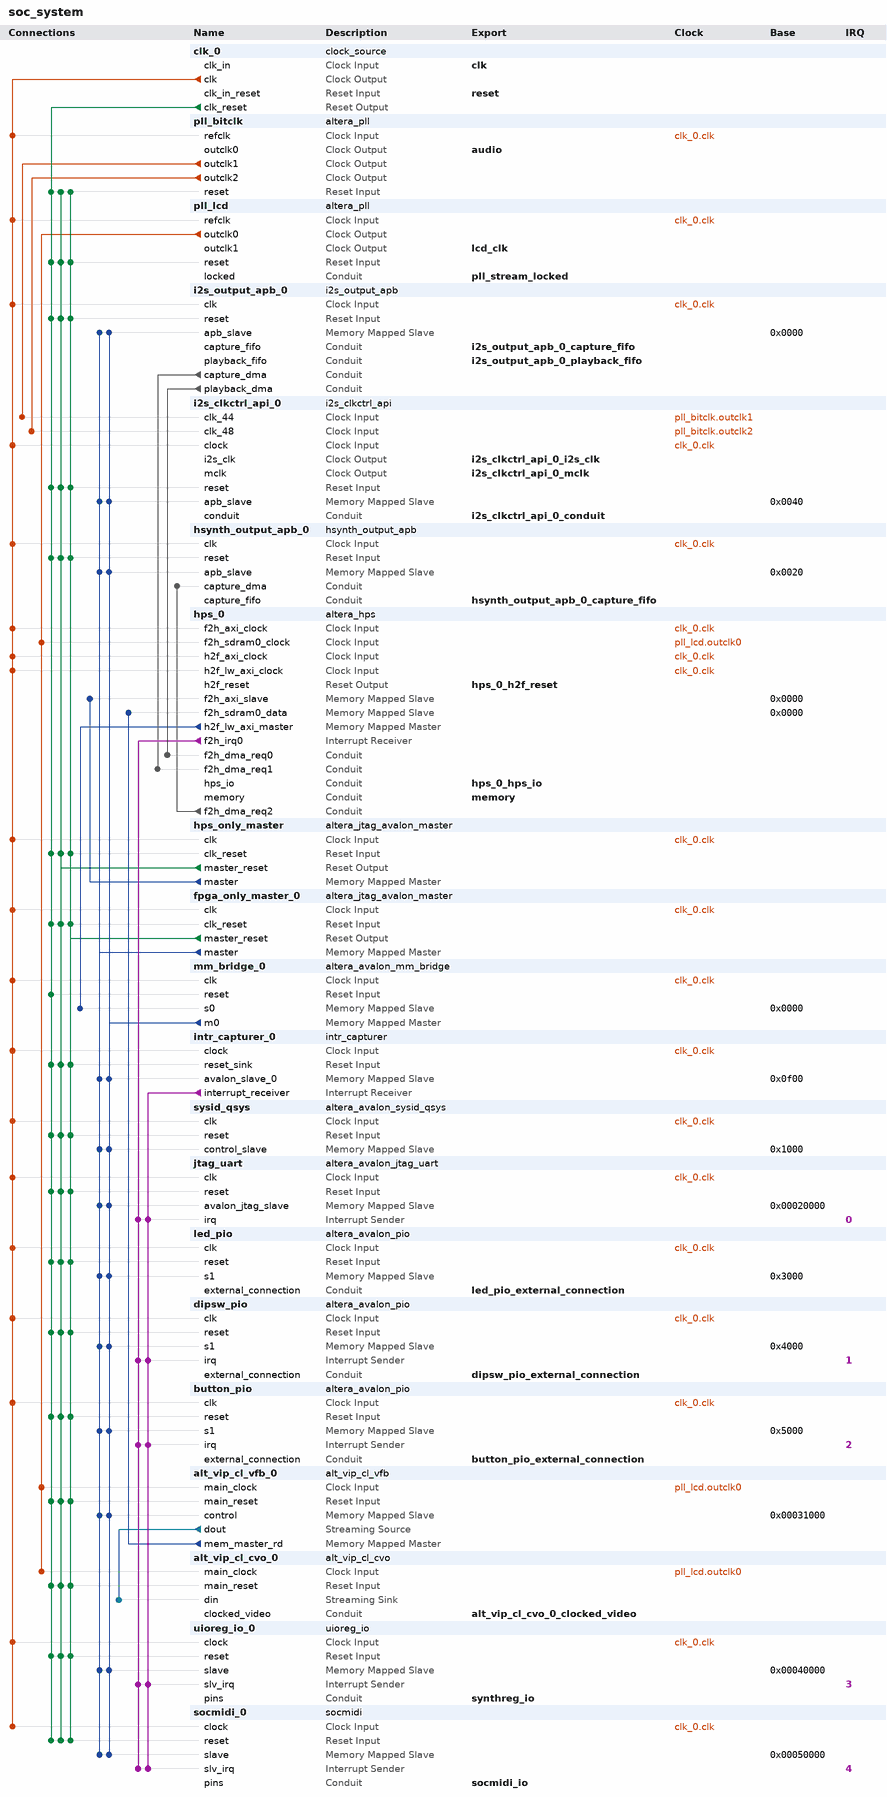
[diagram p0: system contents]
# Platform Designer (Qsys) system soc_system, Cyclone V 5CSEMA5F31C6
# Parameters at their usual value, and those the tool derives, are not listed.
package require -exact qsys 17.1
create_system soc_system
set_project_property DEVICE_FAMILY {Cyclone V}
set_project_property DEVICE 5CSEMA5F31C6

add_instance clk_0 clock_source 17.1
set_instance_parameter_value clk_0 clockFrequency 50000000

add_instance pll_bitclk altera_pll 17.1
set_instance_parameter_value pll_bitclk gui_actual_output_clock_frequency0 {98.333333 MHz}
set_instance_parameter_value pll_bitclk gui_device_speed_grade 2
set_instance_parameter_value pll_bitclk gui_number_of_clocks 3
set_instance_parameter_value pll_bitclk gui_operation_mode direct
set_instance_parameter_value pll_bitclk gui_output_clock_frequency0 90.416666
set_instance_parameter_value pll_bitclk gui_output_clock_frequency1 33.90625
set_instance_parameter_value pll_bitclk gui_output_clock_frequency2 24.675
set_instance_parameter_value pll_bitclk gui_pll_mode {Integer-N PLL}
set_instance_parameter_value pll_bitclk gui_reference_clock_frequency 50.0
set_instance_parameter_value pll_bitclk gui_use_locked false

add_instance pll_lcd altera_pll 17.1
set_instance_parameter_value pll_lcd gui_device_speed_grade 2
set_instance_parameter_value pll_lcd gui_number_of_clocks 2
set_instance_parameter_value pll_lcd gui_operation_mode normal
set_instance_parameter_value pll_lcd gui_output_clock_frequency0 150.0
set_instance_parameter_value pll_lcd gui_output_clock_frequency1 75.0
set_instance_parameter_value pll_lcd gui_pll_mode {Integer-N PLL}
set_instance_parameter_value pll_lcd gui_reference_clock_frequency 50.0
set_instance_parameter_value pll_lcd gui_use_locked true

add_instance i2s_output_apb_0 i2s_output_apb 1.4

add_instance i2s_clkctrl_api_0 i2s_clkctrl_api 1.7

add_instance hsynth_output_apb_0 hsynth_output_apb 1.4

add_instance hps_0 altera_hps 17.1
set_instance_parameter_value hps_0 DMA_Enable Yes,Yes,Yes,No,No,No,No,No
set_instance_parameter_value hps_0 EMAC1_Mode RGMII
set_instance_parameter_value hps_0 EMAC1_PinMuxing {HPS I/O Set 0}
set_instance_parameter_value hps_0 F2SCLK_COLDRST_Enable false
set_instance_parameter_value hps_0 F2SCLK_DBGRST_Enable false
set_instance_parameter_value hps_0 F2SCLK_WARMRST_Enable false
set_instance_parameter_value hps_0 F2SDRAM_Type AXI-3
set_instance_parameter_value hps_0 F2SDRAM_Width 128
set_instance_parameter_value hps_0 F2SINTERRUPT_Enable true
set_instance_parameter_value hps_0 F2S_Width 3
set_instance_parameter_value hps_0 FPGA_PERIPHERAL_OUTPUT_CLOCK_FREQ_EMAC0_GTX_CLK 100
set_instance_parameter_value hps_0 FPGA_PERIPHERAL_OUTPUT_CLOCK_FREQ_EMAC0_MD_CLK 100.0
set_instance_parameter_value hps_0 FPGA_PERIPHERAL_OUTPUT_CLOCK_FREQ_EMAC1_GTX_CLK 100
set_instance_parameter_value hps_0 FPGA_PERIPHERAL_OUTPUT_CLOCK_FREQ_EMAC1_MD_CLK 100.0
set_instance_parameter_value hps_0 HPS_PROTOCOL DDR3
set_instance_parameter_value hps_0 I2C0_Mode I2C
set_instance_parameter_value hps_0 I2C0_PinMuxing {HPS I/O Set 0}
set_instance_parameter_value hps_0 I2C1_Mode I2C
set_instance_parameter_value hps_0 I2C1_PinMuxing {HPS I/O Set 0}
set_instance_parameter_value hps_0 LWH2F_Enable true
set_instance_parameter_value hps_0 MEM_BANKADDR_WIDTH 3
set_instance_parameter_value hps_0 MEM_CLK_FREQ 400.0
set_instance_parameter_value hps_0 MEM_COL_ADDR_WIDTH 10
set_instance_parameter_value hps_0 MEM_DQ_WIDTH 32
set_instance_parameter_value hps_0 MEM_DRV_STR RZQ/7
set_instance_parameter_value hps_0 MEM_ROW_ADDR_WIDTH 15
set_instance_parameter_value hps_0 MEM_RTT_NOM RZQ/4
set_instance_parameter_value hps_0 MEM_RTT_WR RZQ/4
set_instance_parameter_value hps_0 MEM_TCL 11
set_instance_parameter_value hps_0 MEM_TFAW_NS 30.0
set_instance_parameter_value hps_0 MEM_TRAS_NS 35.0
set_instance_parameter_value hps_0 MEM_TRCD_NS 13.75
set_instance_parameter_value hps_0 MEM_TRFC_NS 260.0
set_instance_parameter_value hps_0 MEM_TRP_NS 13.75
set_instance_parameter_value hps_0 MEM_VENDOR JEDEC
set_instance_parameter_value hps_0 MEM_WTCL 8
set_instance_parameter_value hps_0 QSPI_Mode {1 SS}
set_instance_parameter_value hps_0 QSPI_PinMuxing {HPS I/O Set 0}
set_instance_parameter_value hps_0 REF_CLK_FREQ 25.0
set_instance_parameter_value hps_0 S2FCLK_USER2CLK 5
set_instance_parameter_value hps_0 S2F_Width 2
set_instance_parameter_value hps_0 SDIO_Mode {4-bit Data}
set_instance_parameter_value hps_0 SDIO_PinMuxing {HPS I/O Set 0}
set_instance_parameter_value hps_0 SPIM1_Mode {Single Slave Select}
set_instance_parameter_value hps_0 SPIM1_PinMuxing {HPS I/O Set 0}
set_instance_parameter_value hps_0 STM_Enable false
set_instance_parameter_value hps_0 TIMING_BOARD_AC_SKEW 0.03
set_instance_parameter_value hps_0 TIMING_BOARD_AC_TO_CK_SKEW 0.0
set_instance_parameter_value hps_0 TIMING_BOARD_DQ_TO_DQS_SKEW 0.0
set_instance_parameter_value hps_0 TIMING_BOARD_MAX_CK_DELAY 0.03
set_instance_parameter_value hps_0 TIMING_BOARD_MAX_DQS_DELAY 0.02
set_instance_parameter_value hps_0 TIMING_BOARD_SKEW_BETWEEN_DQS 0.08
set_instance_parameter_value hps_0 TIMING_BOARD_SKEW_CKDQS_DIMM_MAX 0.16
set_instance_parameter_value hps_0 TIMING_BOARD_SKEW_CKDQS_DIMM_MIN 0.09
set_instance_parameter_value hps_0 TIMING_BOARD_SKEW_WITHIN_DQS 0.01
set_instance_parameter_value hps_0 TIMING_TDH 65
set_instance_parameter_value hps_0 TIMING_TDQSCK 255
set_instance_parameter_value hps_0 TIMING_TDQSQ 125
set_instance_parameter_value hps_0 TIMING_TDS 30
set_instance_parameter_value hps_0 TIMING_TIH 140
set_instance_parameter_value hps_0 TIMING_TIS 180
set_instance_parameter_value hps_0 TIMING_TQSH 0.4
set_instance_parameter_value hps_0 UART0_Mode {No Flow Control}
set_instance_parameter_value hps_0 UART0_PinMuxing {HPS I/O Set 0}
set_instance_parameter_value hps_0 USB1_Mode SDR
set_instance_parameter_value hps_0 USB1_PinMuxing {HPS I/O Set 0}
set_instance_parameter_value hps_0 desired_cfg_clk_mhz 100.0
set_instance_parameter_value hps_0 desired_mpu_clk_mhz 920.0
set_instance_parameter_value hps_0 desired_qspi_clk_mhz 370.0

add_instance hps_only_master altera_jtag_avalon_master 17.1

add_instance fpga_only_master_0 altera_jtag_avalon_master 17.1

add_instance mm_bridge_0 altera_avalon_mm_bridge 17.1
set_instance_parameter_value mm_bridge_0 ADDRESS_UNITS SYMBOLS
set_instance_parameter_value mm_bridge_0 ADDRESS_WIDTH 10
set_instance_parameter_value mm_bridge_0 DATA_WIDTH 32
set_instance_parameter_value mm_bridge_0 MAX_PENDING_RESPONSES 4
set_instance_parameter_value mm_bridge_0 USE_AUTO_ADDRESS_WIDTH 1

add_instance intr_capturer_0 intr_capturer 100.99.98.97

add_instance sysid_qsys altera_avalon_sysid_qsys 17.1
set_instance_parameter_value sysid_qsys id -1395322110

add_instance jtag_uart altera_avalon_jtag_uart 17.1
set_instance_parameter_value jtag_uart allowMultipleConnections true
set_instance_parameter_value jtag_uart simInteractiveOptions INTERACTIVE_ASCII_OUTPUT

add_instance led_pio altera_avalon_pio 17.1
set_instance_parameter_value led_pio direction Output
set_instance_parameter_value led_pio width 10

add_instance dipsw_pio altera_avalon_pio 17.1
set_instance_parameter_value dipsw_pio bitClearingEdgeCapReg true
set_instance_parameter_value dipsw_pio captureEdge true
set_instance_parameter_value dipsw_pio direction Input
set_instance_parameter_value dipsw_pio edgeType ANY
set_instance_parameter_value dipsw_pio generateIRQ true
set_instance_parameter_value dipsw_pio irqType EDGE
set_instance_parameter_value dipsw_pio width 10

add_instance button_pio altera_avalon_pio 17.1
set_instance_parameter_value button_pio bitClearingEdgeCapReg true
set_instance_parameter_value button_pio captureEdge true
set_instance_parameter_value button_pio direction Input
set_instance_parameter_value button_pio edgeType FALLING
set_instance_parameter_value button_pio generateIRQ true
set_instance_parameter_value button_pio irqType EDGE
set_instance_parameter_value button_pio width 2

add_instance alt_vip_cl_vfb_0 alt_vip_cl_vfb 17.1
set_instance_parameter_value alt_vip_cl_vfb_0 CLOCKS_ARE_SEPARATE 0
set_instance_parameter_value alt_vip_cl_vfb_0 DROP_FRAMES 1
set_instance_parameter_value alt_vip_cl_vfb_0 DROP_INVALID_FIELDS 1
set_instance_parameter_value alt_vip_cl_vfb_0 DROP_REPEAT_USER 0
set_instance_parameter_value alt_vip_cl_vfb_0 IS_FRAME_READER 1
set_instance_parameter_value alt_vip_cl_vfb_0 LINE_BASED_BUFFERING 0
set_instance_parameter_value alt_vip_cl_vfb_0 MAX_HEIGHT 768
set_instance_parameter_value alt_vip_cl_vfb_0 MAX_WIDTH 1366
set_instance_parameter_value alt_vip_cl_vfb_0 MEM_BASE_ADDR 536870912
set_instance_parameter_value alt_vip_cl_vfb_0 MEM_BUFFER_OFFSET 16777216
set_instance_parameter_value alt_vip_cl_vfb_0 MEM_PORT_WIDTH 512
set_instance_parameter_value alt_vip_cl_vfb_0 NUMBER_OF_COLOR_PLANES 4
set_instance_parameter_value alt_vip_cl_vfb_0 READER_RUNTIME_CONTROL 1
set_instance_parameter_value alt_vip_cl_vfb_0 READ_BURST_TARGET 64
set_instance_parameter_value alt_vip_cl_vfb_0 READ_FIFO_DEPTH 512
set_instance_parameter_value alt_vip_cl_vfb_0 USER_PACKETS_MAX_STORAGE 0
set_instance_parameter_value alt_vip_cl_vfb_0 USE_BUFFER_OFFSET 0
set_instance_parameter_value alt_vip_cl_vfb_0 WRITE_BURST_TARGET 64
set_instance_parameter_value alt_vip_cl_vfb_0 WRITE_FIFO_DEPTH 512

add_instance alt_vip_cl_cvo_0 alt_vip_cl_cvo 17.1
set_instance_parameter_value alt_vip_cl_cvo_0 ACCEPT_COLOURS_IN_SEQ 0
set_instance_parameter_value alt_vip_cl_cvo_0 ACCEPT_SYNC 0
set_instance_parameter_value alt_vip_cl_cvo_0 ANC_LINE 0
set_instance_parameter_value alt_vip_cl_cvo_0 AP_LINE 0
set_instance_parameter_value alt_vip_cl_cvo_0 BPS 8
set_instance_parameter_value alt_vip_cl_cvo_0 CLOCKS_ARE_SAME 0
set_instance_parameter_value alt_vip_cl_cvo_0 COLOUR_PLANES_ARE_IN_PARALLEL 1
set_instance_parameter_value alt_vip_cl_cvo_0 CONTEXT_WIDTH 8
set_instance_parameter_value alt_vip_cl_cvo_0 COUNT_STEP_IS_PIP_VALUE 0
set_instance_parameter_value alt_vip_cl_cvo_0 DST_WIDTH 8
set_instance_parameter_value alt_vip_cl_cvo_0 FIELD0_ANC_LINE 0
set_instance_parameter_value alt_vip_cl_cvo_0 FIELD0_V_BACK_PORCH 0
set_instance_parameter_value alt_vip_cl_cvo_0 FIELD0_V_BLANK 0
set_instance_parameter_value alt_vip_cl_cvo_0 FIELD0_V_FRONT_PORCH 0
set_instance_parameter_value alt_vip_cl_cvo_0 FIELD0_V_RISING_EDGE 0
set_instance_parameter_value alt_vip_cl_cvo_0 FIELD0_V_SYNC_LENGTH 0
set_instance_parameter_value alt_vip_cl_cvo_0 FIFO_DEPTH 1366
set_instance_parameter_value alt_vip_cl_cvo_0 F_FALLING_EDGE 0
set_instance_parameter_value alt_vip_cl_cvo_0 F_RISING_EDGE 0
set_instance_parameter_value alt_vip_cl_cvo_0 GENERATE_SYNC 0
set_instance_parameter_value alt_vip_cl_cvo_0 H_ACTIVE_PIXELS 1366
set_instance_parameter_value alt_vip_cl_cvo_0 H_BACK_PORCH 16
set_instance_parameter_value alt_vip_cl_cvo_0 H_BLANK 0
set_instance_parameter_value alt_vip_cl_cvo_0 H_FRONT_PORCH 40
set_instance_parameter_value alt_vip_cl_cvo_0 H_SYNC_LENGTH 32
set_instance_parameter_value alt_vip_cl_cvo_0 INTERLACED 0
set_instance_parameter_value alt_vip_cl_cvo_0 LOW_LATENCY 0
set_instance_parameter_value alt_vip_cl_cvo_0 NO_OF_CHANNELS 1
set_instance_parameter_value alt_vip_cl_cvo_0 NO_OF_MODES 1
set_instance_parameter_value alt_vip_cl_cvo_0 NUMBER_OF_COLOUR_PLANES 4
set_instance_parameter_value alt_vip_cl_cvo_0 PIXELS_IN_PARALLEL 1
set_instance_parameter_value alt_vip_cl_cvo_0 SRC_WIDTH 8
set_instance_parameter_value alt_vip_cl_cvo_0 STD_WIDTH 1
set_instance_parameter_value alt_vip_cl_cvo_0 TASK_WIDTH 8
set_instance_parameter_value alt_vip_cl_cvo_0 THRESHOLD 1365
set_instance_parameter_value alt_vip_cl_cvo_0 USE_CONTROL 0
set_instance_parameter_value alt_vip_cl_cvo_0 USE_EMBEDDED_SYNCS 0
set_instance_parameter_value alt_vip_cl_cvo_0 V_ACTIVE_LINES 768
set_instance_parameter_value alt_vip_cl_cvo_0 V_BACK_PORCH 16
set_instance_parameter_value alt_vip_cl_cvo_0 V_BLANK 0
set_instance_parameter_value alt_vip_cl_cvo_0 V_FRONT_PORCH 5
set_instance_parameter_value alt_vip_cl_cvo_0 V_SYNC_LENGTH 4

add_instance uioreg_io_0 uioreg_io 1.1
set_instance_parameter_value uioreg_io_0 ADDRESS_WIDTH 10
set_instance_parameter_value uioreg_io_0 DATA_WIDTH 32
set_instance_parameter_value uioreg_io_0 IRQ_EN 1

add_instance socmidi_0 socmidi 1.0
set_instance_parameter_value socmidi_0 ADDRESS_WIDTH 3
set_instance_parameter_value socmidi_0 DATA_WIDTH 8
set_instance_parameter_value socmidi_0 IRQ_EN 0

# connections
add_connection clk_0.clk button_pio.clk clock
add_connection clk_0.clk dipsw_pio.clk clock
add_connection clk_0.clk fpga_only_master_0.clk clock
add_connection clk_0.clk hps_0.f2h_axi_clock clock
add_connection clk_0.clk hps_0.h2f_axi_clock clock
add_connection clk_0.clk hps_0.h2f_lw_axi_clock clock
add_connection clk_0.clk hps_only_master.clk clock
add_connection clk_0.clk hsynth_output_apb_0.clk clock
add_connection clk_0.clk i2s_clkctrl_api_0.clock clock
add_connection clk_0.clk i2s_output_apb_0.clk clock
add_connection clk_0.clk intr_capturer_0.clock clock
add_connection clk_0.clk jtag_uart.clk clock
add_connection clk_0.clk led_pio.clk clock
add_connection clk_0.clk mm_bridge_0.clk clock
add_connection clk_0.clk pll_bitclk.refclk clock
add_connection clk_0.clk pll_lcd.refclk clock
add_connection clk_0.clk socmidi_0.clock clock
add_connection clk_0.clk sysid_qsys.clk clock
add_connection clk_0.clk uioreg_io_0.clock clock
add_connection pll_bitclk.outclk1 i2s_clkctrl_api_0.clk_44 clock
add_connection pll_bitclk.outclk2 i2s_clkctrl_api_0.clk_48 clock
add_connection pll_lcd.outclk0 alt_vip_cl_cvo_0.main_clock clock
add_connection pll_lcd.outclk0 alt_vip_cl_vfb_0.main_clock clock
add_connection pll_lcd.outclk0 hps_0.f2h_sdram0_clock clock
add_connection clk_0.clk_reset alt_vip_cl_cvo_0.main_reset reset
add_connection clk_0.clk_reset alt_vip_cl_vfb_0.main_reset reset
add_connection clk_0.clk_reset button_pio.reset reset
add_connection clk_0.clk_reset dipsw_pio.reset reset
add_connection clk_0.clk_reset fpga_only_master_0.clk_reset reset
add_connection clk_0.clk_reset hps_only_master.clk_reset reset
add_connection clk_0.clk_reset hsynth_output_apb_0.reset reset
add_connection clk_0.clk_reset i2s_clkctrl_api_0.reset reset
add_connection clk_0.clk_reset i2s_output_apb_0.reset reset
add_connection clk_0.clk_reset intr_capturer_0.reset_sink reset
add_connection clk_0.clk_reset jtag_uart.reset reset
add_connection clk_0.clk_reset led_pio.reset reset
add_connection clk_0.clk_reset mm_bridge_0.reset reset
add_connection clk_0.clk_reset pll_bitclk.reset reset
add_connection clk_0.clk_reset pll_lcd.reset reset
add_connection clk_0.clk_reset socmidi_0.reset reset
add_connection clk_0.clk_reset sysid_qsys.reset reset
add_connection clk_0.clk_reset uioreg_io_0.reset reset
add_connection fpga_only_master_0.master_reset alt_vip_cl_cvo_0.main_reset reset
add_connection fpga_only_master_0.master_reset alt_vip_cl_vfb_0.main_reset reset
add_connection fpga_only_master_0.master_reset button_pio.reset reset
add_connection fpga_only_master_0.master_reset dipsw_pio.reset reset
add_connection fpga_only_master_0.master_reset fpga_only_master_0.clk_reset reset
add_connection fpga_only_master_0.master_reset hps_only_master.clk_reset reset
add_connection fpga_only_master_0.master_reset hsynth_output_apb_0.reset reset
add_connection fpga_only_master_0.master_reset i2s_clkctrl_api_0.reset reset
add_connection fpga_only_master_0.master_reset i2s_output_apb_0.reset reset
add_connection fpga_only_master_0.master_reset intr_capturer_0.reset_sink reset
add_connection fpga_only_master_0.master_reset jtag_uart.reset reset
add_connection fpga_only_master_0.master_reset led_pio.reset reset
add_connection fpga_only_master_0.master_reset pll_bitclk.reset reset
add_connection fpga_only_master_0.master_reset pll_lcd.reset reset
add_connection fpga_only_master_0.master_reset socmidi_0.reset reset
add_connection fpga_only_master_0.master_reset sysid_qsys.reset reset
add_connection fpga_only_master_0.master_reset uioreg_io_0.reset reset
add_connection hps_only_master.master_reset alt_vip_cl_cvo_0.main_reset reset
add_connection hps_only_master.master_reset alt_vip_cl_vfb_0.main_reset reset
add_connection hps_only_master.master_reset button_pio.reset reset
add_connection hps_only_master.master_reset dipsw_pio.reset reset
add_connection hps_only_master.master_reset fpga_only_master_0.clk_reset reset
add_connection hps_only_master.master_reset hps_only_master.clk_reset reset
add_connection hps_only_master.master_reset hsynth_output_apb_0.reset reset
add_connection hps_only_master.master_reset i2s_clkctrl_api_0.reset reset
add_connection hps_only_master.master_reset i2s_output_apb_0.reset reset
add_connection hps_only_master.master_reset intr_capturer_0.reset_sink reset
add_connection hps_only_master.master_reset jtag_uart.reset reset
add_connection hps_only_master.master_reset led_pio.reset reset
add_connection hps_only_master.master_reset pll_bitclk.reset reset
add_connection hps_only_master.master_reset pll_lcd.reset reset
add_connection hps_only_master.master_reset socmidi_0.reset reset
add_connection hps_only_master.master_reset sysid_qsys.reset reset
add_connection hps_only_master.master_reset uioreg_io_0.reset reset
add_connection alt_vip_cl_vfb_0.mem_master_rd hps_0.f2h_sdram0_data avalon
set_connection_parameter_value alt_vip_cl_vfb_0.mem_master_rd/hps_0.f2h_sdram0_data baseAddress 0x0000
add_connection fpga_only_master_0.master alt_vip_cl_vfb_0.control avalon
set_connection_parameter_value fpga_only_master_0.master/alt_vip_cl_vfb_0.control baseAddress 0x00031000
add_connection fpga_only_master_0.master button_pio.s1 avalon
set_connection_parameter_value fpga_only_master_0.master/button_pio.s1 baseAddress 0x5000
add_connection fpga_only_master_0.master dipsw_pio.s1 avalon
set_connection_parameter_value fpga_only_master_0.master/dipsw_pio.s1 baseAddress 0x4000
add_connection fpga_only_master_0.master hsynth_output_apb_0.apb_slave avalon
set_connection_parameter_value fpga_only_master_0.master/hsynth_output_apb_0.apb_slave baseAddress 0x0020
add_connection fpga_only_master_0.master i2s_clkctrl_api_0.apb_slave avalon
set_connection_parameter_value fpga_only_master_0.master/i2s_clkctrl_api_0.apb_slave baseAddress 0x0040
add_connection fpga_only_master_0.master i2s_output_apb_0.apb_slave avalon
set_connection_parameter_value fpga_only_master_0.master/i2s_output_apb_0.apb_slave baseAddress 0x0000
add_connection fpga_only_master_0.master intr_capturer_0.avalon_slave_0 avalon
set_connection_parameter_value fpga_only_master_0.master/intr_capturer_0.avalon_slave_0 baseAddress 0x0f00
add_connection fpga_only_master_0.master jtag_uart.avalon_jtag_slave avalon
set_connection_parameter_value fpga_only_master_0.master/jtag_uart.avalon_jtag_slave baseAddress 0x00020000
add_connection fpga_only_master_0.master led_pio.s1 avalon
set_connection_parameter_value fpga_only_master_0.master/led_pio.s1 baseAddress 0x3000
add_connection fpga_only_master_0.master socmidi_0.slave avalon
set_connection_parameter_value fpga_only_master_0.master/socmidi_0.slave baseAddress 0x00050000
add_connection fpga_only_master_0.master sysid_qsys.control_slave avalon
set_connection_parameter_value fpga_only_master_0.master/sysid_qsys.control_slave baseAddress 0x1000
add_connection fpga_only_master_0.master uioreg_io_0.slave avalon
set_connection_parameter_value fpga_only_master_0.master/uioreg_io_0.slave baseAddress 0x00040000
add_connection hps_0.h2f_lw_axi_master mm_bridge_0.s0 avalon
set_connection_parameter_value hps_0.h2f_lw_axi_master/mm_bridge_0.s0 baseAddress 0x0000
add_connection hps_only_master.master hps_0.f2h_axi_slave avalon
set_connection_parameter_value hps_only_master.master/hps_0.f2h_axi_slave baseAddress 0x0000
add_connection mm_bridge_0.m0 alt_vip_cl_vfb_0.control avalon
set_connection_parameter_value mm_bridge_0.m0/alt_vip_cl_vfb_0.control baseAddress 0x00031000
add_connection mm_bridge_0.m0 button_pio.s1 avalon
set_connection_parameter_value mm_bridge_0.m0/button_pio.s1 baseAddress 0x5000
add_connection mm_bridge_0.m0 dipsw_pio.s1 avalon
set_connection_parameter_value mm_bridge_0.m0/dipsw_pio.s1 baseAddress 0x4000
add_connection mm_bridge_0.m0 hsynth_output_apb_0.apb_slave avalon
set_connection_parameter_value mm_bridge_0.m0/hsynth_output_apb_0.apb_slave baseAddress 0x0020
add_connection mm_bridge_0.m0 i2s_clkctrl_api_0.apb_slave avalon
set_connection_parameter_value mm_bridge_0.m0/i2s_clkctrl_api_0.apb_slave baseAddress 0x0040
add_connection mm_bridge_0.m0 i2s_output_apb_0.apb_slave avalon
set_connection_parameter_value mm_bridge_0.m0/i2s_output_apb_0.apb_slave baseAddress 0x0000
add_connection mm_bridge_0.m0 intr_capturer_0.avalon_slave_0 avalon
set_connection_parameter_value mm_bridge_0.m0/intr_capturer_0.avalon_slave_0 baseAddress 0x0f00
add_connection mm_bridge_0.m0 jtag_uart.avalon_jtag_slave avalon
set_connection_parameter_value mm_bridge_0.m0/jtag_uart.avalon_jtag_slave baseAddress 0x00020000
add_connection mm_bridge_0.m0 led_pio.s1 avalon
set_connection_parameter_value mm_bridge_0.m0/led_pio.s1 baseAddress 0x3000
add_connection mm_bridge_0.m0 socmidi_0.slave avalon
set_connection_parameter_value mm_bridge_0.m0/socmidi_0.slave baseAddress 0x00050000
add_connection mm_bridge_0.m0 sysid_qsys.control_slave avalon
set_connection_parameter_value mm_bridge_0.m0/sysid_qsys.control_slave baseAddress 0x1000
add_connection mm_bridge_0.m0 uioreg_io_0.slave avalon
set_connection_parameter_value mm_bridge_0.m0/uioreg_io_0.slave baseAddress 0x00040000
add_connection alt_vip_cl_vfb_0.dout alt_vip_cl_cvo_0.din avalon_streaming
add_connection hps_0.f2h_dma_req2 hsynth_output_apb_0.capture_dma conduit
add_connection i2s_output_apb_0.capture_dma hps_0.f2h_dma_req1 conduit
add_connection i2s_output_apb_0.playback_dma hps_0.f2h_dma_req0 conduit
add_connection hps_0.f2h_irq0 button_pio.irq interrupt
set_connection_parameter_value hps_0.f2h_irq0/button_pio.irq irqNumber 2
add_connection hps_0.f2h_irq0 dipsw_pio.irq interrupt
set_connection_parameter_value hps_0.f2h_irq0/dipsw_pio.irq irqNumber 1
add_connection hps_0.f2h_irq0 jtag_uart.irq interrupt
set_connection_parameter_value hps_0.f2h_irq0/jtag_uart.irq irqNumber 0
add_connection hps_0.f2h_irq0 socmidi_0.slv_irq interrupt
set_connection_parameter_value hps_0.f2h_irq0/socmidi_0.slv_irq irqNumber 4
add_connection hps_0.f2h_irq0 uioreg_io_0.slv_irq interrupt
set_connection_parameter_value hps_0.f2h_irq0/uioreg_io_0.slv_irq irqNumber 3
add_connection intr_capturer_0.interrupt_receiver button_pio.irq interrupt
set_connection_parameter_value intr_capturer_0.interrupt_receiver/button_pio.irq irqNumber 2
add_connection intr_capturer_0.interrupt_receiver dipsw_pio.irq interrupt
set_connection_parameter_value intr_capturer_0.interrupt_receiver/dipsw_pio.irq irqNumber 1
add_connection intr_capturer_0.interrupt_receiver jtag_uart.irq interrupt
set_connection_parameter_value intr_capturer_0.interrupt_receiver/jtag_uart.irq irqNumber 0
add_connection intr_capturer_0.interrupt_receiver socmidi_0.slv_irq interrupt
set_connection_parameter_value intr_capturer_0.interrupt_receiver/socmidi_0.slv_irq irqNumber 4
add_connection intr_capturer_0.interrupt_receiver uioreg_io_0.slv_irq interrupt
set_connection_parameter_value intr_capturer_0.interrupt_receiver/uioreg_io_0.slv_irq irqNumber 3

# exported interfaces
add_interface alt_vip_cl_cvo_0_clocked_video conduit end
set_interface_property alt_vip_cl_cvo_0_clocked_video EXPORT_OF alt_vip_cl_cvo_0.clocked_video
add_interface audio clock source
set_interface_property audio EXPORT_OF pll_bitclk.outclk0
add_interface button_pio_external_connection conduit end
set_interface_property button_pio_external_connection EXPORT_OF button_pio.external_connection
add_interface clk clock sink
set_interface_property clk EXPORT_OF clk_0.clk_in
add_interface dipsw_pio_external_connection conduit end
set_interface_property dipsw_pio_external_connection EXPORT_OF dipsw_pio.external_connection
add_interface hps_0_h2f_reset reset source
set_interface_property hps_0_h2f_reset EXPORT_OF hps_0.h2f_reset
add_interface hps_0_hps_io conduit end
set_interface_property hps_0_hps_io EXPORT_OF hps_0.hps_io
add_interface hsynth_output_apb_0_capture_fifo conduit end
set_interface_property hsynth_output_apb_0_capture_fifo EXPORT_OF hsynth_output_apb_0.capture_fifo
add_interface i2s_clkctrl_api_0_conduit conduit end
set_interface_property i2s_clkctrl_api_0_conduit EXPORT_OF i2s_clkctrl_api_0.conduit
add_interface i2s_clkctrl_api_0_i2s_clk clock source
set_interface_property i2s_clkctrl_api_0_i2s_clk EXPORT_OF i2s_clkctrl_api_0.i2s_clk
add_interface i2s_clkctrl_api_0_mclk clock source
set_interface_property i2s_clkctrl_api_0_mclk EXPORT_OF i2s_clkctrl_api_0.mclk
add_interface i2s_output_apb_0_capture_fifo conduit end
set_interface_property i2s_output_apb_0_capture_fifo EXPORT_OF i2s_output_apb_0.capture_fifo
add_interface i2s_output_apb_0_playback_fifo conduit end
set_interface_property i2s_output_apb_0_playback_fifo EXPORT_OF i2s_output_apb_0.playback_fifo
add_interface lcd_clk clock source
set_interface_property lcd_clk EXPORT_OF pll_lcd.outclk1
add_interface led_pio_external_connection conduit end
set_interface_property led_pio_external_connection EXPORT_OF led_pio.external_connection
add_interface memory conduit end
set_interface_property memory EXPORT_OF hps_0.memory
add_interface pll_stream_locked conduit end
set_interface_property pll_stream_locked EXPORT_OF pll_lcd.locked
add_interface reset reset sink
set_interface_property reset EXPORT_OF clk_0.clk_in_reset
add_interface socmidi_io conduit end
set_interface_property socmidi_io EXPORT_OF socmidi_0.pins
add_interface synthreg_io conduit end
set_interface_property synthreg_io EXPORT_OF uioreg_io_0.pins

set_interconnect_requirement {$system} qsys_mm.clockCrossingAdapter AUTO
set_interconnect_requirement {$system} qsys_mm.maxAdditionalLatency 2

save_system soc_system.qsys
